# Altium schematic sheet Interfaces and Connectors - Sensors.SCHDOC
size A4
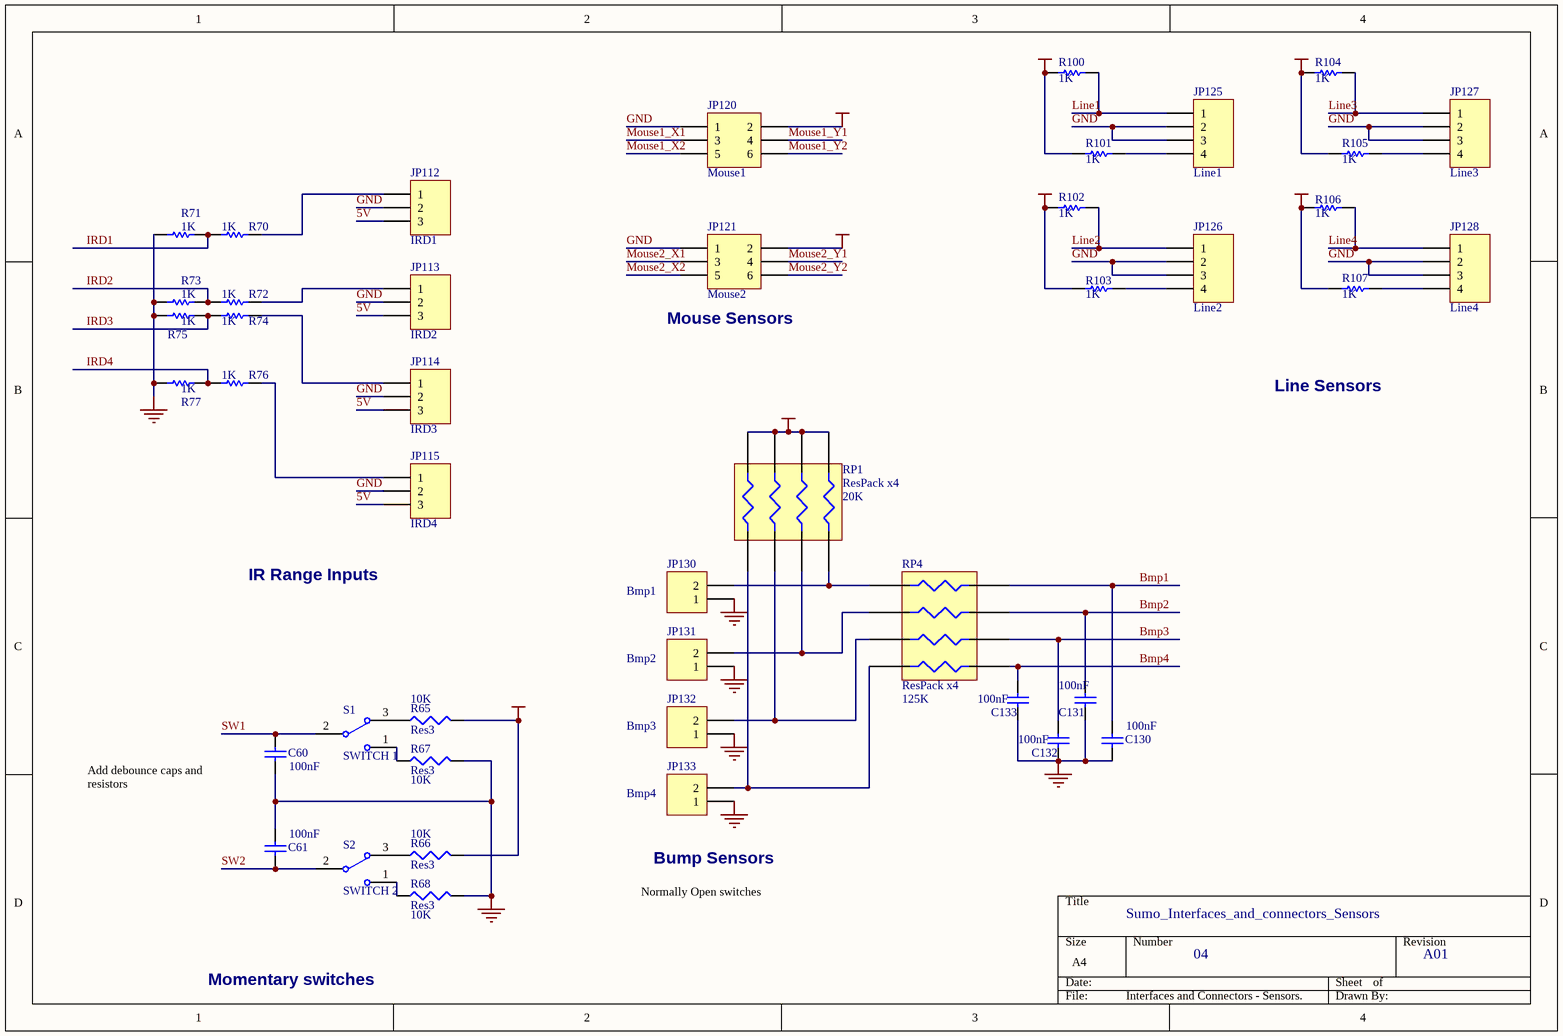
[diagram p0: Interfaces and Connectors - Sensors.SCHDOC]

## Parts
C60  value 100nF  [CR2012-0805]  (hidden comment: Cap Semi)
C61  value 100nF  [CR2012-0805]  (hidden comment: Cap Semi)
C130  value 100nF  [CR2012-0805]  (hidden comment: Cap Semi)
C131  value 100nF  [CR2012-0805]  (hidden comment: Cap Semi)
C132  value 100nF  [CR2012-0805]  (hidden comment: Cap Semi)
C133  value 100nF  [CR2012-0805]  (hidden comment: Cap Semi)
JP112  IRD1  [ZHR 1x3 1.5mm]
JP113  IRD2  [ZHR 1x3 1.5mm]
JP114  IRD3  [ZHR 1x3 1.5mm]
JP115  IRD4  [ZHR 1x3 1.5mm]
JP120  Mouse1  [PHR 1x6 2mm]
JP121  Mouse2  [PHR 1x6 2mm]
JP125  Line1  [EHR 1x4 2.5mm]
JP126  Line2  [EHR 1x4 2.5mm]
JP127  Line3  [EHR 1x4 2.5mm]
JP128  Line4  [EHR 1x4 2.5mm]
JP130  Bmp1  [KK 1x2 2.54mm]
JP131  Bmp2  [KK 1x2 2.54mm]
JP132  Bmp3  [KK 1x2 2.54mm]
JP133  Bmp4  [KK 1x2 2.54mm]
R65  Res3  value 10K  [R2012-0805]
R66  Res3  value 10K  [R2012-0805]
R67  Res3  value 10K  [R2012-0805]
R68  Res3  value 10K  [R2012-0805]
R70  value 1K  [CR2012-0805]  (hidden comment: Res1)
R71  value 1K  [CR2012-0805]  (hidden comment: Res1)
R72  value 1K  [CR2012-0805]  (hidden comment: Res1)
R73  value 1K  [CR2012-0805]  (hidden comment: Res1)
R74  value 1K  [CR2012-0805]  (hidden comment: Res1)
R75  value 1K  [CR2012-0805]  (hidden comment: Res1)
R76  value 1K  [CR2012-0805]  (hidden comment: Res1)
R77  value 1K  [CR2012-0805]  (hidden comment: Res1)
R100  value 1K  [R2012-0805]  (hidden comment: Res1)
R101  value 1K  [R2012-0805]  (hidden comment: Res1)
R102  value 1K  [R2012-0805]  (hidden comment: Res1)
R103  value 1K  [R2012-0805]  (hidden comment: Res1)
R104  value 1K  [R2012-0805]  (hidden comment: Res1)
R105  value 1K  [R2012-0805]  (hidden comment: Res1)
R106  value 1K  [R2012-0805]  (hidden comment: Res1)
R107  value 1K  [R2012-0805]  (hidden comment: Res1)
RP1  ResPack x4  value 20K  [4x0805 Resistor pack]
RP4  ResPack x4  value 125K  [4x0805 Resistor pack]
S1  SWITCH 1  [SW SPDT]
S2  SWITCH 2  [SW SPDT]

## Nets
5V: JP112.3 JP113.3 JP114.3 JP115.3 JP120.2 JP121.2 R65.2 R66.2 R100.1 R101.1 R102.1 R103.1 R104.1 R105.1 R106.1 R107.1 RP1.5 RP1.6 RP1.7 RP1.8
GND: C60.1 C61.2 C130.1 C131.1 C132.1 C133.1 JP112.2 JP113.2 JP114.2 JP115.2 JP120.1 JP121.1 JP125.2 JP125.3 JP126.2 JP126.3 JP127.2 JP127.3 JP128.2 JP128.3 JP130.1 JP131.1 JP132.1 JP133.1 R67.2 R68.2 R71.1 R73.1 R75.1 R77.1
Bmp1: C130.2 RP4.8
Bmp2: C131.2 RP4.7
Bmp3: C132.2 RP4.6
Bmp4: C133.2 RP4.5
IRD1: R70.1 R71.2
IRD2: R72.1 R73.2
IRD3: R74.1 R75.2
IRD4: R76.1 R77.2
Line1: JP125.1 R100.2
Line2: JP126.1 R102.2
Line3: JP127.1 R104.2
Line4: JP128.1 R106.2
Mouse1_X1: JP120.3
Mouse1_X2: JP120.5
Mouse1_Y1: JP120.4
Mouse1_Y2: JP120.6
Mouse2_X1: JP121.3
Mouse2_X2: JP121.5
Mouse2_Y1: JP121.4
Mouse2_Y2: JP121.6
SW1: C60.2 S1.2
SW2: C61.1 S2.2
NetJP112_1: JP112.1 R70.2
NetJP113_1: JP113.1 R72.2
NetJP114_1: JP114.1 R74.2
NetJP115_1: JP115.1 R76.2
NetJP125_4: JP125.4 R101.2
NetJP126_4: JP126.4 R103.2
NetJP127_4: JP127.4 R105.2
NetJP128_4: JP128.4 R107.2
NetJP130_2: JP130.2 RP1.4 RP4.1
NetJP131_2: JP131.2 RP1.3 RP4.2
NetJP132_2: JP132.2 RP1.2 RP4.3
NetJP133_2: JP133.2 RP1.1 RP4.4
NetR65_1: R65.1 S1.3
NetR66_1: R66.1 S2.3
NetR67_1: R67.1 S1.1
NetR68_1: R68.1 S2.1

## Notes on the sheet
- (near JP121) Mouse Sensors
- Line Sensors
- IR Range Inputs
- Add debounce caps and resistors
- (near JP133) Bump Sensors
- Sumo_Interfaces_and_connectors_Sensors
- Momentary switches
- Normally Open switches
- 04
- A01

## Library data of the parts
C60 C61 C130-C133 = Cap Semi: Capacitor (Semiconductor SIM Model); Published: 8-Jun-2000; Revision: July-2002: Re-released for DXP Platform.; Publisher: Altium Limited
JP112-JP115 = MHDR1X3: Header, 3-Pin; Revision: 17-Jul-2002: Re-released for DXP Platform.; Publisher: Altium Limited
JP120 JP121 = Header 3X2: Header, 3-Pin, Dual row; Revision: 17-Jul-2002: Re-released for DXP Platform.; Publisher: Altium Limited
JP125-JP128 = Header 4H: Header, 4-Pin, Right Angle; Revision: 17-Jul-2002: Re-released for DXP Platform.; Publisher: Altium Limited
JP130-JP133 = Header 2: Header, 2-Pin; Revision: 17-Jul-2002: Re-released for DXP Platform.; Publisher: Altium Limited
R65-R68 = Res3: Resistor; Published: 8-Jun-2000; Revision: July-2002: Re-released for DXP Platform.; Publisher: Altium Limited
R70-R77 R100-R107 = Res1: Resistor; Published: 8-Jun-2000; Revision: July-2002: Re-released for DXP Platform.; Publisher: Altium Limited
S1 S2 = SW-SPDT: SPDT Subminiature Toggle Switch, Right Angle Mounting, Vertical Actuation; Revision 1: Jul-2002: Re-released for DXP Platform.; Revision 2: 17-Dec-2003: Schematic revised, PCB Footprint replaced.; Published: 24-Mar-1999; Datasheet: Latest Revision: 05-Dec-2000; Publisher: Altium Limited